# Altium schematic sheet THS7002CPWP_Schematic.SchDoc
size A; SheetNumber: 12; SheetTotal: 15
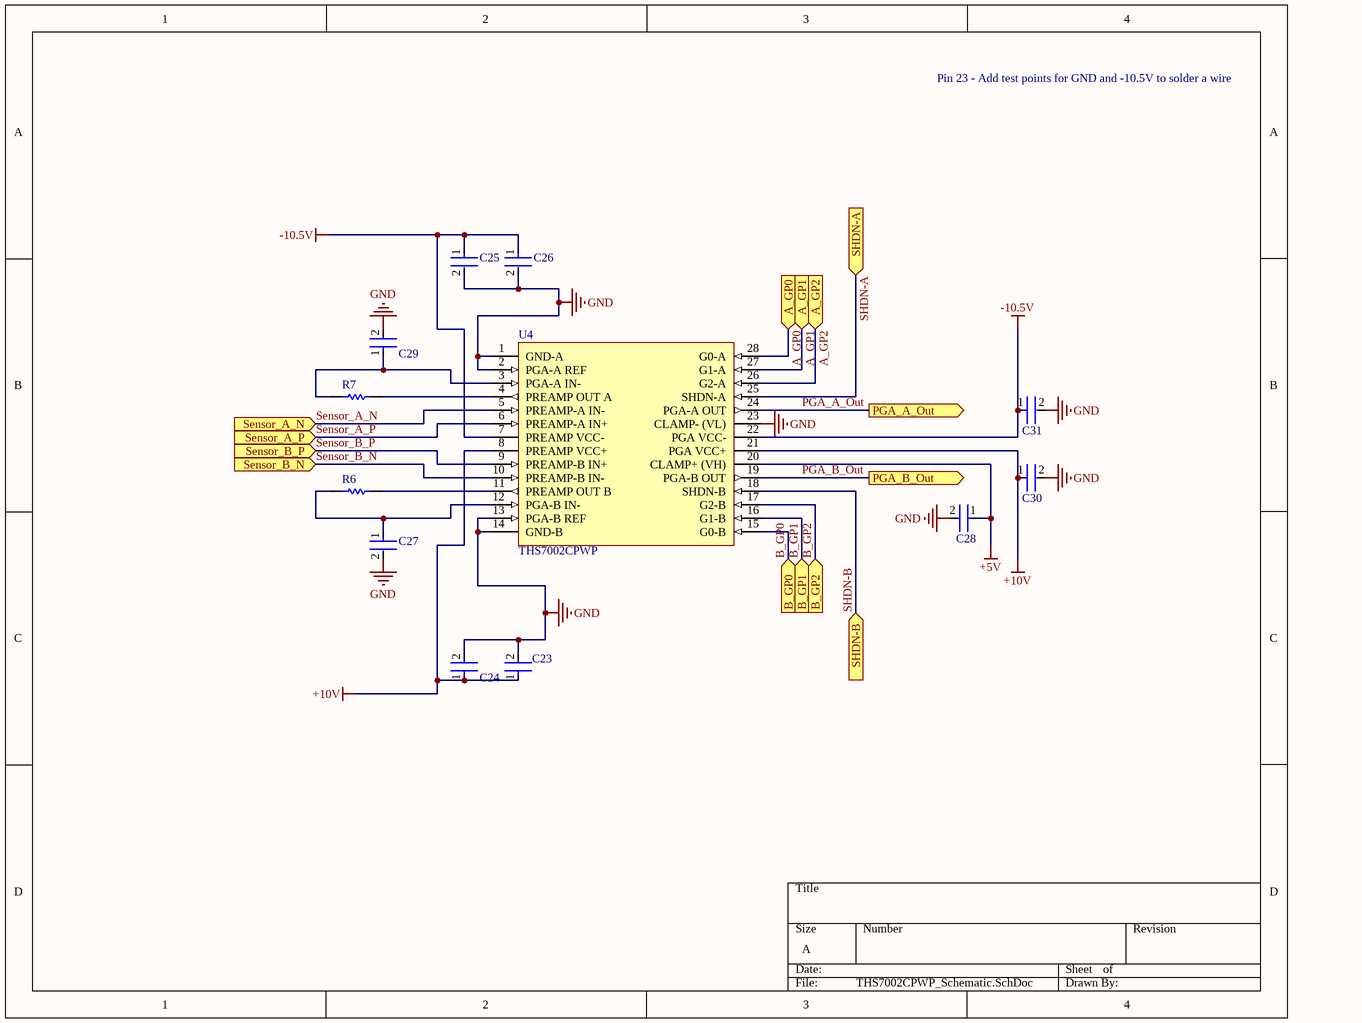
[diagram p0: THS7002CPWP_Schematic.SchDoc]

## Parts
C23  C2012JB1A685K060AC  [FP-C2012-060-0_2-IPC_A]  (value not drawn)
C24  CC0603KRX7R7BB104  [FP-CC0603-DA-MFG]  (value not drawn)
C25  CC0603KRX7R7BB104  [FP-CC0603-DA-MFG]  (value not drawn)
C26  C2012JB1A685K060AC  [FP-C2012-060-0_2-IPC_A]  (value not drawn)
C27  GRM3195C1H163JA01D  [FP-GRM319-0_15-IPC_A]  (value not drawn)
C28  C2012JB1A685K060AC  [FP-C2012-060-0_2-IPC_A]  (value not drawn)
C29  GRM3195C1H163JA01D  [FP-GRM319-0_15-IPC_A]  (value not drawn)
C30  CC0603KRX7R7BB104  [FP-CC0603-DA-MFG]  (value not drawn)
C31  CC0603KRX7R7BB104  [FP-CC0603-DA-MFG]  (value not drawn)
R6  CRCW08050000Z0EA  [RESC2013X50X30LL20T20]  (value not drawn)
R7  CRCW08050000Z0EA  [RESC2013X50X30LL20T20]  (value not drawn)
U4  THS7002CPWP  [PWP0028E_M]

## Ports
A_GP0 (in), A_GP1 (in), A_GP2 (in), B_GP0 (in), B_GP1 (in), B_GP2 (in), PGA_A_Out (out), PGA_B_Out (out), Sensor_A_N (in), Sensor_A_P (in), Sensor_B_N (in), Sensor_B_P (in), SHDN-A (in), SHDN-B (in)

## Nets
+5V: C28.1 U4.20(CLAMP+_(VH))
+10V: C23.1 C24.1 C30.1 U4.8(PREAMP_VCC+) U4.21(PGA_VCC+)
-10.5V: C25.1 C26.1 C31.1 U4.7(PREAMP_VCC-) U4.22(PGA_VCC-)
GND: C23.2 C24.2 C25.2 C26.2 C27.2 C28.2 C29.2 C30.2 C31.2 U4.1(GND-A) U4.2(PGA-A_REF) U4.13(PGA-B_REF) U4.14(GND-B) U4.23(CLAMP-_(VL))
A_GP0: U4.28(G0-A) ; port A_GP0
A_GP1: U4.27(G1-A) ; port A_GP1
A_GP2: U4.26(G2-A) ; port A_GP2
B_GP0: U4.15(G0-B) ; port B_GP0
B_GP1: U4.16(G1-B) ; port B_GP1
B_GP2: U4.17(G2-B) ; port B_GP2
PGA_A_Out: U4.24(PGA-A_OUT) ; port PGA_A_Out
PGA_B_Out: U4.19(PGA-B_OUT) ; port PGA_B_Out
Sensor_A_N: U4.5(PREAMP-A_IN-) ; port Sensor_A_N
Sensor_A_P: U4.6(PREAMP-A_IN+) ; port Sensor_A_P
Sensor_B_N: U4.10(PREAMP-B_IN-) ; port Sensor_B_N
Sensor_B_P: U4.9(PREAMP-B_IN+) ; port Sensor_B_P
SHDN-A: U4.25(SHDN-A) ; port SHDN-A
SHDN-B: U4.18(SHDN-B) ; port SHDN-B
NetC27_1: C27.1 R6.1 U4.12(PGA-B_IN-)
NetC29_1: C29.1 R7.1 U4.3(PGA-A_IN-)
NetR6_2: R6.2 U4.11(PREAMP_OUT_B)
NetR7_2: R7.2 U4.4(PREAMP_OUT_A)

## Notes on the sheet
- Pin 23 - Add test points for GND and -10.5V to solder a wire

## Library data of the parts
C23 C26 C28 = CMP-08246-004641-1: Multilayer Ceramic Capacitors 6.8μF ±10% 10V JB SMD 0805; Capacitance: 6.8uF; RoHS Compliant: Yes; Case Code (Metric): 5032; Case/Package: 0805; Voltage Rating: 10V; Width: 0.049inch; Min Operating Temperature: -25°C; Mount: Surface Mount; Voltage Rating (DC): 10V; Dielectric Material: Ceramic; Case Code (Imperial): 2012; Package Quantity: 4000; Lead Free: Lead Free; Packaging: Tape and Reel; Length: 0.079inch; Tolerance: 10%; Thickness: 0.028inch; Max Operating Temperature: 85°C; Series: C
C24 C25 C30 C31 = CMP-2000-05002-2: CAP CER 0.1UF 16V X7R 0603; Manufacturer: YAGEO; Tolerance: 0.1; Value: 100 nF; Temperature Coefficient: 15%; Material: Ceramic; Voltage Rating: 16 V; Package: CC0603-DA; ComponentLink2Description: Datasheet; Octopart: https://octopart.com/cc0603krx7r7bb104-yageo-192941; Temperature Range High: +125°C; Digikey Description: CAP CER 0.1UF 16V X7R 0603; Voltage: 16 V; Device Class L2: Capacitors; Height: 0.9mm; Temperature: -55°C to +125°C; Manufacturer Part Number: CC0603KRX7R7BB104; Device Class L1: Passive Components; Device Class L3: Ceramic Capacitors; ComponentLink2URL: http://www.yageo.com/documents/recent/UPY-GPHC_X7R_6.3V-to-50V_18.pdf; Footprint Url: http://www.yageo.com/exep/pages/download/literatures/UPY-C_GEN_24.pdf; RoHS: TRUE; Temperature Range Low: -55°C; Temperature Characteristic: X7R; Lead Free: Yes; Capacitance: 100 nF; Category: Cap; Mouser Description: Multilayer Ceramic Capacitor, CC Series, 0.1 - F, - 10%, X7R, 16 V, 0603 [1608 Metric]; Automotive: No
C27 C29 = CMP-06035-007665-1: Chip Multilayer Ceramic Capacitors for General Purpose, 1206, 16000pF, C0G, 30ppm/°C, 5%, 50V; Capacitance: 16nF; Tolerance: 5%; Case Code (Metric): 3216; Length: 3.2mm; Package Quantity: 4000; Mount: Surface Mount; Voltage Rating (DC): 50V; Voltage Rating: 50V; Case Code (Imperial): 1206; Height: 0.85mm; Min Operating Temperature: -55°C; Max Operating Temperature: 125°C; Termination: SMD/SMT; Width: 0.063inch; Radiation Hardening: No; Depth: 1.6mm; Thickness: 0.037inch; Dielectric: C0G; Case/Package: 1206; Packaging: Tape and Reel
R6 R7 = CMP-2001-04896-1: Manufacturer: Vishay Dale; Part Number: CRCW08050000Z0EA
U4 = CMP-0988-00132-2: 70-MHz High-Speed Programmable-Gain Amplifier, Dual, 0 to 70 degC, 28-pin SOP (PWP28), Green (RoHS & no Sb/Br); Manufacturer: Texas Instruments; Disable: TRUE; BW @ Acl(MHz): 100; Vs(Min)(V): 9; Vs(Max)(V): 32; Number of Channels: 2; Vio(Max)(mV): 7; Iib(Max)(nA): 6000; SubFamily: Variable Gain Amplifier; Vn at Flatband(Typ)(nV/rtHz): 1.7; Slew Rate(Typ)(V/us): 85; ComponentLink1Description: Manufacturer URL; Code_JEDEC: MO-153; PackageVersion: 4073225-6/I, 05/2011; PackageReference: PWP0028E; Eco-Plan: Green (RoHS & no Sb/Br); ComponentLink2URL: http://www.ti.com/general/docs/lit/getliterature.tsp?genericPartNumber=THS7002&fileType=pdf; PackageDescription: 28-Pin Plastic Small Outline, Body 4.4 x 9.7 mm, Pitch 0.65 mm; DatasheetVersion: SLOS214C; ComponentLink3URL: http://www.ti.com/litv/pdf/mpds373; ComponentLink3Description: Package Specification; ComponentLink1URL: http://www.ti.com/; ComponentLink2Description: Datasheet; Mounting Technology: Surface Mount; PartNumber: THS7002CPWP